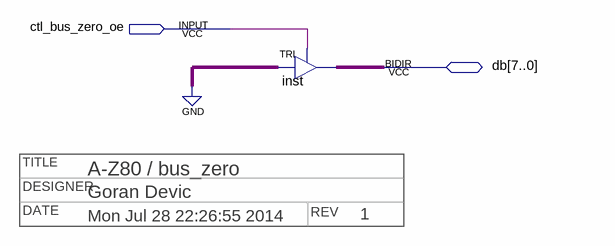
[diagram p0: schematic sheet]
// Quartus schematic bus_zero.bdf as structural Verilog: 1 symbols, 2 pins
// Title block: TITLE: A-Z80 / bus_zero; DESIGNER: Goran Devic; DATE: Mon Jul 28 22:26:55 2014; REV: 1
module bus_zero (
  input  ctl_bus_zero_oe,
  inout  [7:0] db
);

  TRI inst[7:0] (.IN({8{1'b0}}), .OE(ctl_bus_zero_oe), .OUT(db));
endmodule
